# Altium schematic sheet Encodeurs.Schematic.SchDoc
size A
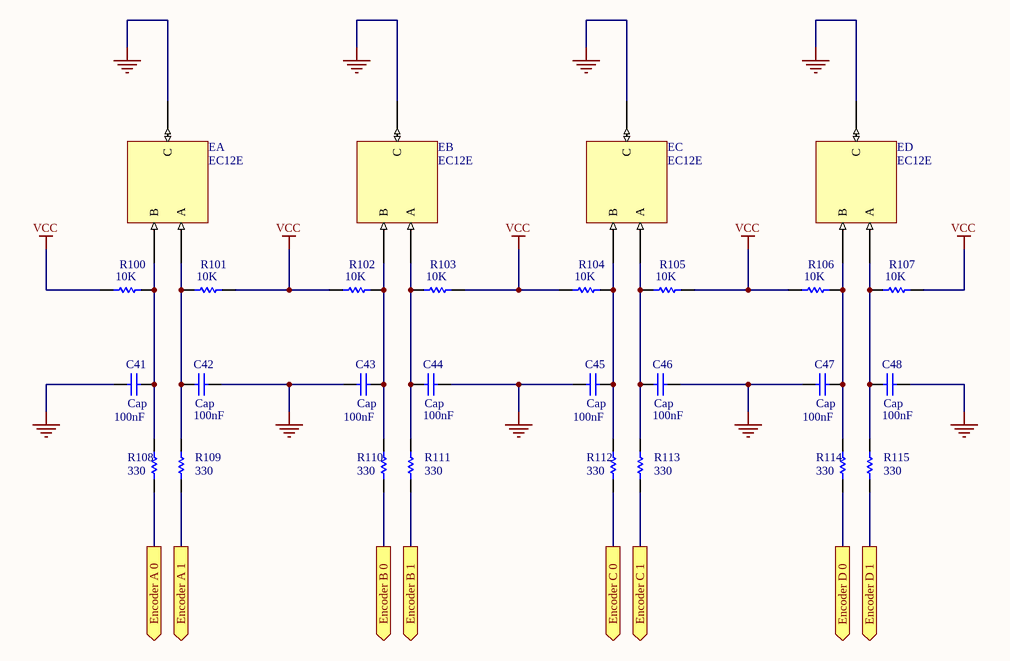
[diagram p0: Encodeurs.Schematic.SchDoc]

## Parts
C41  Cap  value 100nF  [CAPC1608N]
C42  Cap  value 100nF  [CAPC1608N]
C43  Cap  value 100nF  [CAPC1608N]
C44  Cap  value 100nF  [CAPC1608N]
C45  Cap  value 100nF  [CAPC1608N]
C46  Cap  value 100nF  [CAPC1608N]
C47  Cap  value 100nF  [CAPC1608N]
C48  Cap  value 100nF  [CAPC1608N]
EA  EC12E  [EC12E]
EB  EC12E  [EC12E]
EC  EC12E  [EC12E]
ED  EC12E  [EC12E]
R100  10K  [CAPC1608N]
R101  10K  [CAPC1608N]
R102  10K  [CAPC1608N]
R103  10K  [CAPC1608N]
R104  10K  [CAPC1608N]
R105  10K  [CAPC1608N]
R106  10K  [CAPC1608N]
R107  10K  [CAPC1608N]
R108  330  [CAPC1608N]
R109  330  [CAPC1608N]
R110  330  [CAPC1608N]
R111  330  [CAPC1608N]
R112  330  [CAPC1608N]
R113  330  [CAPC1608N]
R114  330  [CAPC1608N]
R115  330  [CAPC1608N]

## Ports
Encoder A 0 (out), Encoder A 1 (out), Encoder B 0 (out), Encoder B 1 (out), Encoder C 0 (out), Encoder C 1 (out), Encoder D 0 (out), Encoder D 1 (out)

## Nets
GND: C41.1 C42.1 C43.1 C44.1 C45.1 C46.1 C47.1 C48.1 EA.GND(C) EB.GND(C) EC.GND(C) ED.GND(C)
VCC: R100.1 R101.2 R102.1 R103.2 R104.1 R105.2 R106.1 R107.2
Encoder A 0: R108.1 ; port Encoder A 0
Encoder A 1: R109.1 ; port Encoder A 1
Encoder B 0: R110.1 ; port Encoder B 0
Encoder B 1: R111.1 ; port Encoder B 1
Encoder C 0: R112.1 ; port Encoder C 0
Encoder C 1: R113.1 ; port Encoder C 1
Encoder D 0: R114.1 ; port Encoder D 0
Encoder D 1: R115.1 ; port Encoder D 1
NetC41_2: C41.2 EA.Pin_B(B) R100.2 R108.2
NetC42_2: C42.2 EA.Pin_A(A) R101.1 R109.2
NetC43_2: C43.2 EB.Pin_B(B) R102.2 R110.2
NetC44_2: C44.2 EB.Pin_A(A) R103.1 R111.2
NetC45_2: C45.2 EC.Pin_B(B) R104.2 R112.2
NetC46_2: C46.2 EC.Pin_A(A) R105.1 R113.2
NetC47_2: C47.2 ED.Pin_B(B) R106.2 R114.2
NetC48_2: C48.2 ED.Pin_A(A) R107.1 R115.2

## Library data of the parts
C41-C48 = Cap: Capacitor; Published: 8-Jun-2000; LatestRevisionDate: 17-Jul-2002; LatestRevisionNote: Re-released for DXP Platform.; PackageReference: RAD-0.3; Publisher: Altium Limited; PackageDescription: Radial Cap, Thru-Hole; 2 Leads; 0.3 in Pin Spacing
R100-R107 = Res1: Resistor; Published: 8-Jun-2000; LatestRevisionDate: 17-Jul-2002; LatestRevisionNote: Re-released for DXP Platform.; PackageReference: AXIAL-0.3; Publisher: Altium Limited; PackageDescription: Axial Device, Thru-Hole; 2 Leads; 0.3 in Pin Spacing; Value: 10K
R108-R115 = Res1: Resistor; Value: 330R; Published: 8-Jun-2000; LatestRevisionDate: 17-Jul-2002; LatestRevisionNote: Re-released for DXP Platform.; PackageReference: AXIAL-0.3; Publisher: Altium Limited; PackageDescription: Axial Device, Thru-Hole; 2 Leads; 0.3 in Pin Spacing